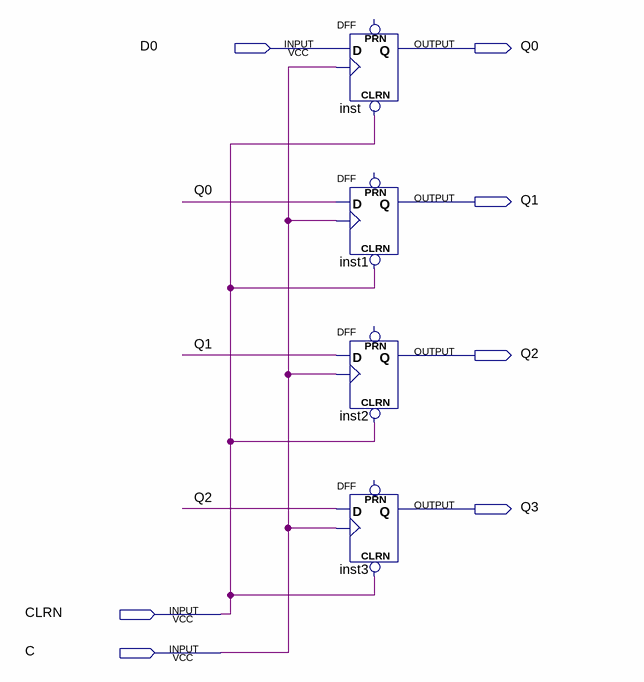
[diagram p0: schematic sheet]
// Quartus schematic lab1.bdf as structural Verilog: 4 symbols, 7 pins
module lab1 (
  input  D0,
  input  CLRN,
  input  C,
  output Q0,
  output Q1,
  output Q2,
  output Q3
);

  DFF inst (.CLRN(CLRN), .CLK(C), .D(D0), .Q(Q0));  // open: PRN
  DFF inst1 (.CLRN(CLRN), .CLK(C), .D(Q0), .Q(Q1));  // open: PRN
  DFF inst2 (.CLRN(CLRN), .CLK(C), .D(Q1), .Q(Q2));  // open: PRN
  DFF inst3 (.CLRN(CLRN), .CLK(C), .D(Q2), .Q(Q3));  // open: PRN
endmodule
